# EasyEDA schematic oLoRa-part-thi.json
TITLE: oLoRa-part-thi; REV: 1.0; Date: 2019-08-19; Sheet: 1/1; Drawn By: 김석현; Company: RMTEC
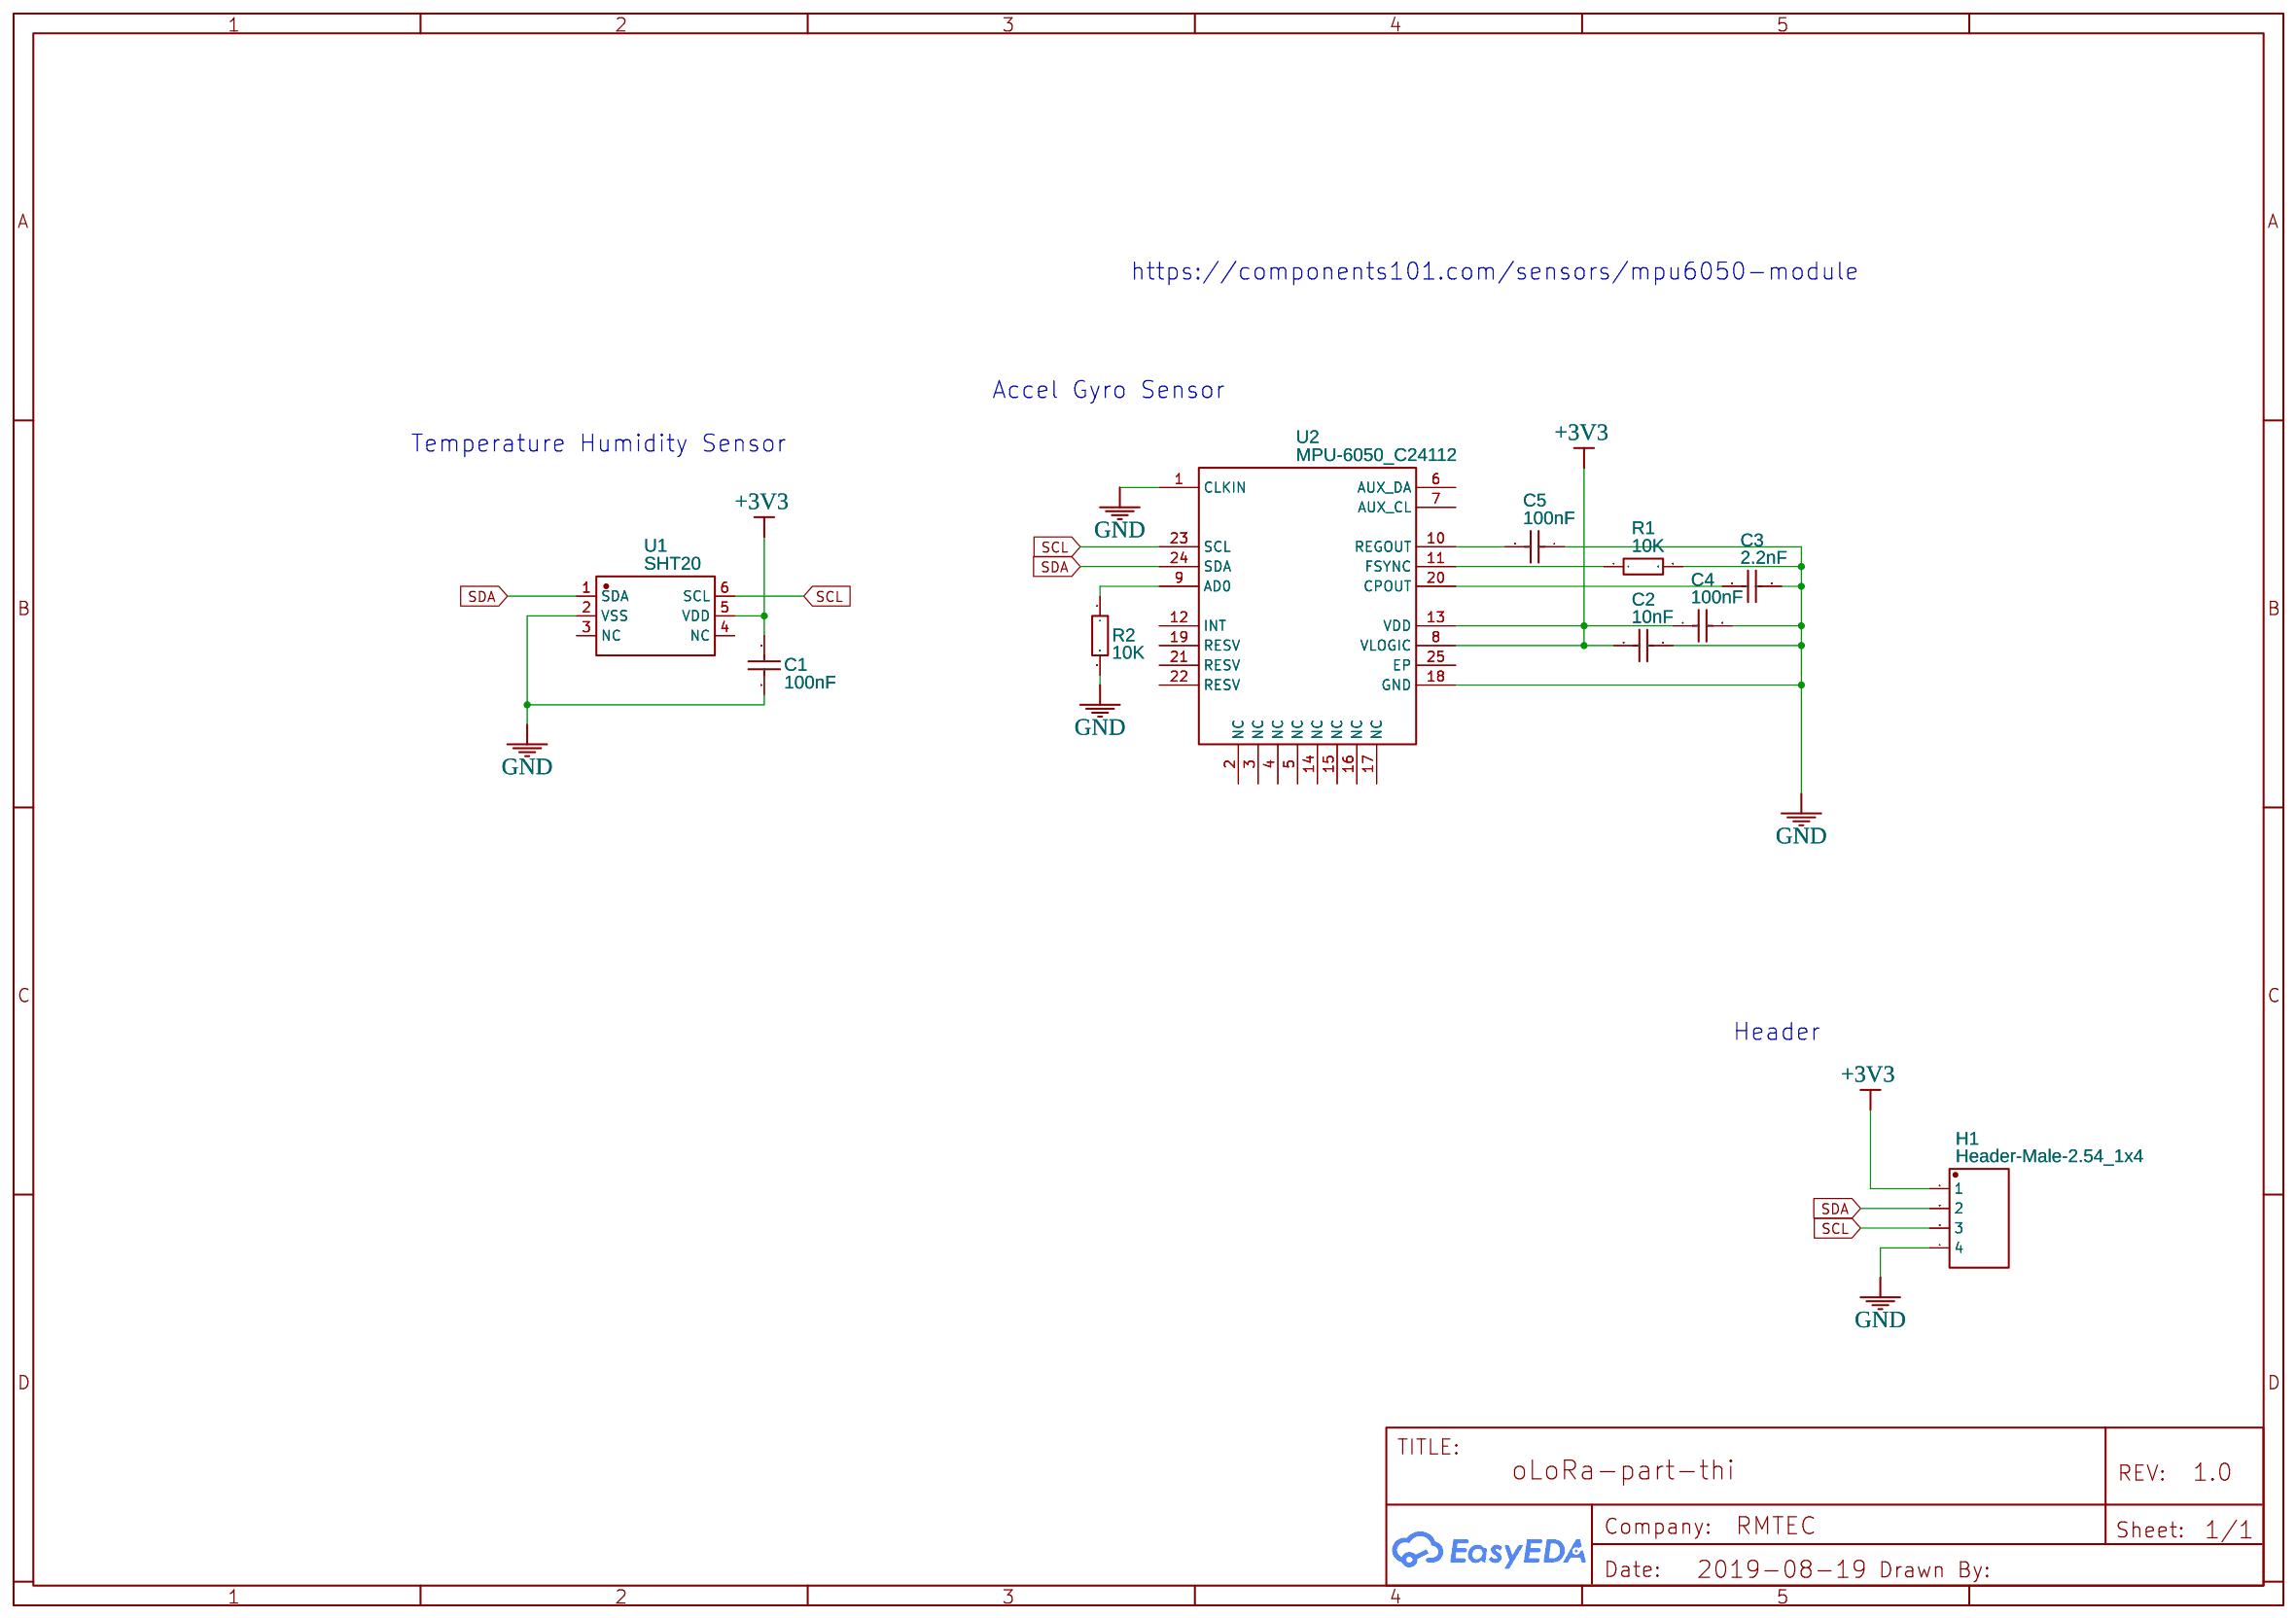
[diagram p0: schematic sheet]

## Parts
C1  100nF  [0603]
C2  10nF  [0603]
C3  2.2nF  [0603]
C4  100nF  [0603]
C5  100nF  [0603]
H1  Header-Male-2.54_1x4  [210S-1X4P]
R1  10K  [0603]
R2  10K  [0603]
U1  SHT20  [DFN-6-EP]
U2  MPU-6050_C24112  [QFN-24_4X4X05P]

## Library data of the parts
C1 C4 C5 = 0603B104K500NT: Supplier: LCSC; Manufacturer: FH; Supplier Part: C30926
C2 = CC0603KRX7R9BB103: Supplier: LCSC; Manufacturer: YAGEO; Supplier Part: C100042
C3 = CC0603KRX7R9BB222: Supplier: LCSC; Manufacturer: YAGEO; Supplier Part: C107082
H1 = -: Supplier: LCSC; Manufacturer: Ckmtw; Manufacturer Part: 210S-1*4P L=11.6MMGold-plated black; Contributor: LCSC; Supplier Part: C124378
R1 R2 = RC0603FR-0710KL: Supplier: LCSC; Manufacturer: YAGEO; Supplier Part: C98220
U1 = -: Supplier: LCSC; Manufacturer: Sensirion; image: //image.lceda.cn/szlcsc/C53865.jpg; Supplier Part: C53865; LCSC Assembly: Yes; SMT Type: Extend
U2 = -: sourceId: 1T5FDZYC8; Supplier: LCSC; Manufacturer: InvenSense; Manufacturer Part: MPU-6050; LCSC Assembly: Yes; image: //image.lceda.cn/szlcsc/C24112.jpg; Supplier Part: C24112; SMT Type: Basic

## Nets
+3V3: C1.1 C2.2 C4.1 H1.1 U1.5(VDD) U2.8(VLOGIC) U2.13(VDD)
GND: C1.2 C2.1 C3.1 C4.2 C5.1 H1.4 R1.2 R2.2 U1.2(VSS) U2.1(CLKIN) U2.18(GND)
SCL: H1.3 U1.6(SCL) U2.23(SCL)
SDA: H1.2 U1.1(SDA) U2.24(SDA)
Net-(C3-2): C3.2 U2.20(CPOUT)
Net-(C5-2): C5.2 U2.10(REGOUT)
Net-(R1-1): R1.1 U2.11(FSYNC)
Net-(R2-1): R2.1 U2.9(AD0)

Not connected (* = marked no-connect by the designer): U1 3(NC) 4(NC); U2 2(NC) 3(NC) 4(NC) 5(NC) 6(AUX_DA) 7(AUX_CL) 12(INT) 14(NC) 15(NC) 16(NC) 17(NC) 19(RESV) 21(RESV) 22(RESV) 25(EP)

## Notes on the sheet
- https://components101.com/sensors/mpu6050-module
- Accel Gyro Sensor
- Temperature Humidity Sensor
- Header
